# Altium schematic sheet SDRAM.SchDoc
size A4; DocumentNumber: 6; SheetNumber: 6; SheetTotal: 15
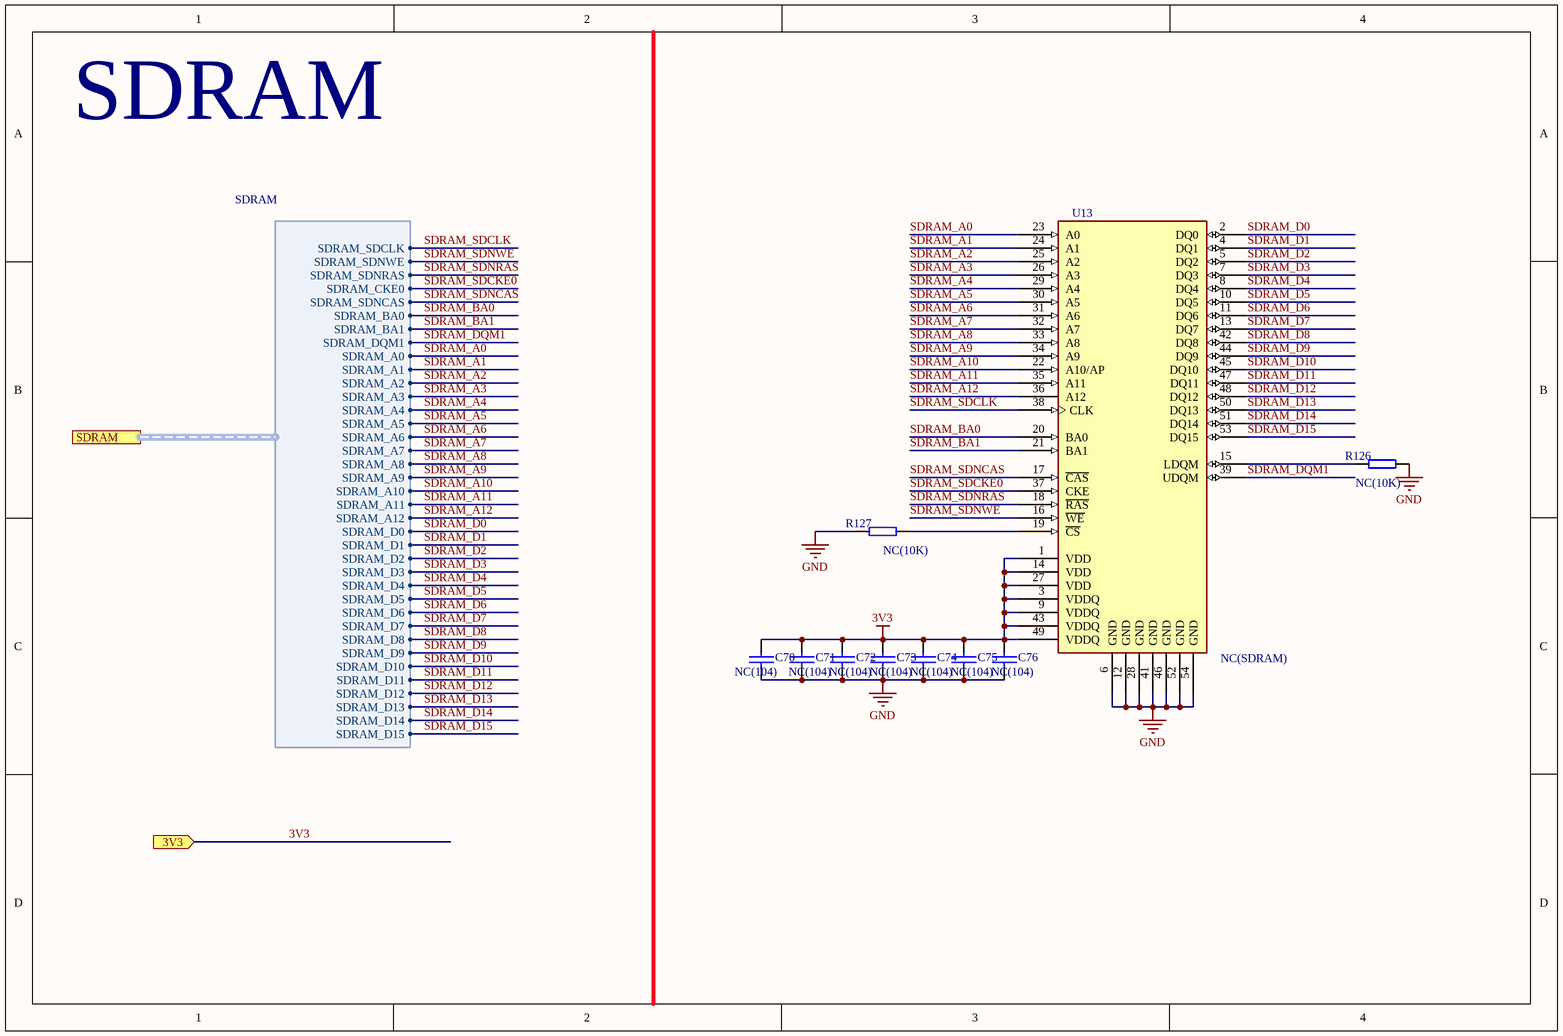
[diagram p0: SDRAM.SchDoc]

## Parts
C70  NC(104)  [0402_C]
C71  NC(104)  [0402_C]
C72  NC(104)  [0402_C]
C73  NC(104)  [0402_C]
C74  NC(104)  [0402_C]
C75  NC(104)  [0402_C]
C76  NC(104)  [0402_C]
R126  NC(10K)  [0402]
R127  NC(10K)  [0402]
U13  NC(SDRAM)  [TSOP-54]

## Ports
3V3 (in), SDRAM (harness SDRAM)

## Harnesses
SDRAM: SDRAM_SDNWE, SDRAM_SDNRAS, SDRAM_CKE0, SDRAM_SDNCAS, SDRAM_BA0, SDRAM_BA1, SDRAM_DQM1, SDRAM_A0, SDRAM_A1, SDRAM_A2, SDRAM_A3, SDRAM_A4, SDRAM_A5, SDRAM_A6, SDRAM_A7, SDRAM_A8, SDRAM_A9, SDRAM_A10, SDRAM_A11, SDRAM_A12, SDRAM_SDCLK, SDRAM_D0, SDRAM_D2, SDRAM_D3, SDRAM_D4, SDRAM_D5, SDRAM_D6, SDRAM_D7, SDRAM_D8, SDRAM_D9, SDRAM_D10, SDRAM_D11, SDRAM_D12, SDRAM_D13, SDRAM_D14, SDRAM_D15, SDRAM_D1

## Nets
3V3: C70.2 C71.2 C72.2 C73.2 C74.2 C75.2 C76.2 U13.1(VDD) U13.3(VDDQ) U13.9(VDDQ) U13.14(VDD) U13.27(VDD) U13.43(VDDQ) U13.49(VDDQ) ; port 3V3
GND: C70.1 C71.1 C72.1 C73.1 C74.1 C75.1 C76.1 R126.1 R127.2 U13.6(GND) U13.12(GND) U13.28(GND) U13.41(GND) U13.46(GND) U13.52(GND) U13.54(GND)
SDRAM_A0: U13.23(A0) ; port SDRAM.SDRAM_A0
SDRAM_A1: U13.24(A1) ; port SDRAM.SDRAM_A1
SDRAM_A2: U13.25(A2) ; port SDRAM.SDRAM_A2
SDRAM_A3: U13.26(A3) ; port SDRAM.SDRAM_A3
SDRAM_A4: U13.29(A4) ; port SDRAM.SDRAM_A4
SDRAM_A5: U13.30(A5) ; port SDRAM.SDRAM_A5
SDRAM_A6: U13.31(A6) ; port SDRAM.SDRAM_A6
SDRAM_A7: U13.32(A7) ; port SDRAM.SDRAM_A7
SDRAM_A8: U13.33(A8) ; port SDRAM.SDRAM_A8
SDRAM_A9: U13.34(A9) ; port SDRAM.SDRAM_A9
SDRAM_A10: U13.22(A10/AP) ; port SDRAM.SDRAM_A10
SDRAM_A11: U13.35(A11) ; port SDRAM.SDRAM_A11
SDRAM_A12: U13.36(A12) ; port SDRAM.SDRAM_A12
SDRAM_BA0: U13.20(BA0) ; port SDRAM.SDRAM_BA0
SDRAM_BA1: U13.21(BA1) ; port SDRAM.SDRAM_BA1
SDRAM_D0: U13.2(DQ0) ; port SDRAM.SDRAM_D0
SDRAM_D1: U13.4(DQ1) ; port SDRAM.SDRAM_D1
SDRAM_D2: U13.5(DQ2) ; port SDRAM.SDRAM_D2
SDRAM_D3: U13.7(DQ3) ; port SDRAM.SDRAM_D3
SDRAM_D4: U13.8(DQ4) ; port SDRAM.SDRAM_D4
SDRAM_D5: U13.10(DQ5) ; port SDRAM.SDRAM_D5
SDRAM_D6: U13.11(DQ6) ; port SDRAM.SDRAM_D6
SDRAM_D7: U13.13(DQ7) ; port SDRAM.SDRAM_D7
SDRAM_D8: U13.42(DQ8) ; port SDRAM.SDRAM_D8
SDRAM_D9: U13.44(DQ9) ; port SDRAM.SDRAM_D9
SDRAM_D10: U13.45(DQ10) ; port SDRAM.SDRAM_D10
SDRAM_D11: U13.47(DQ11) ; port SDRAM.SDRAM_D11
SDRAM_D12: U13.48(DQ12) ; port SDRAM.SDRAM_D12
SDRAM_D13: U13.50(DQ13) ; port SDRAM.SDRAM_D13
SDRAM_D14: U13.51(DQ14) ; port SDRAM.SDRAM_D14
SDRAM_D15: U13.53(DQ15) ; port SDRAM.SDRAM_D15
SDRAM_DQM1: U13.39(UDQM) ; port SDRAM.SDRAM_DQM1
SDRAM_SDCKE0: U13.37(CKE) ; port SDRAM.SDRAM_CKE0
SDRAM_SDCLK: U13.38(CLK) ; port SDRAM.SDRAM_SDCLK
SDRAM_SDNCAS: U13.17(~{CAS}) ; port SDRAM.SDRAM_SDNCAS
SDRAM_SDNRAS: U13.18(~{RAS}) ; port SDRAM.SDRAM_SDNRAS
SDRAM_SDNWE: U13.16(~{WE}) ; port SDRAM.SDRAM_SDNWE
NetR126_2: R126.2 U13.15(LDQM)
NetR127_1: R127.1 U13.19(~{CS})

## Notes on the sheet
- SDRAM

## Library data of the parts
C70-C76 = CAP: Capacitor
R126 R127 = RES
U13 = W9825G6KH-6